# Altium schematic sheet con-bot-j2-0.SchDoc: Connector - J2(Bottom) 0
size Letter; CheckedBy: E. Chiu; CompanyName: Signal Laboratories, Inc.; DrawnBy: J. Brinton; Engineer: J. Brinton; Address1: 3479 Edison Way; Address2: Menlo Park CA 94025; Address3: +1 (877) 778-8435; Address4: brintonengineering.com; Revision: 1; SheetNumber: 20; SheetTotal: 40
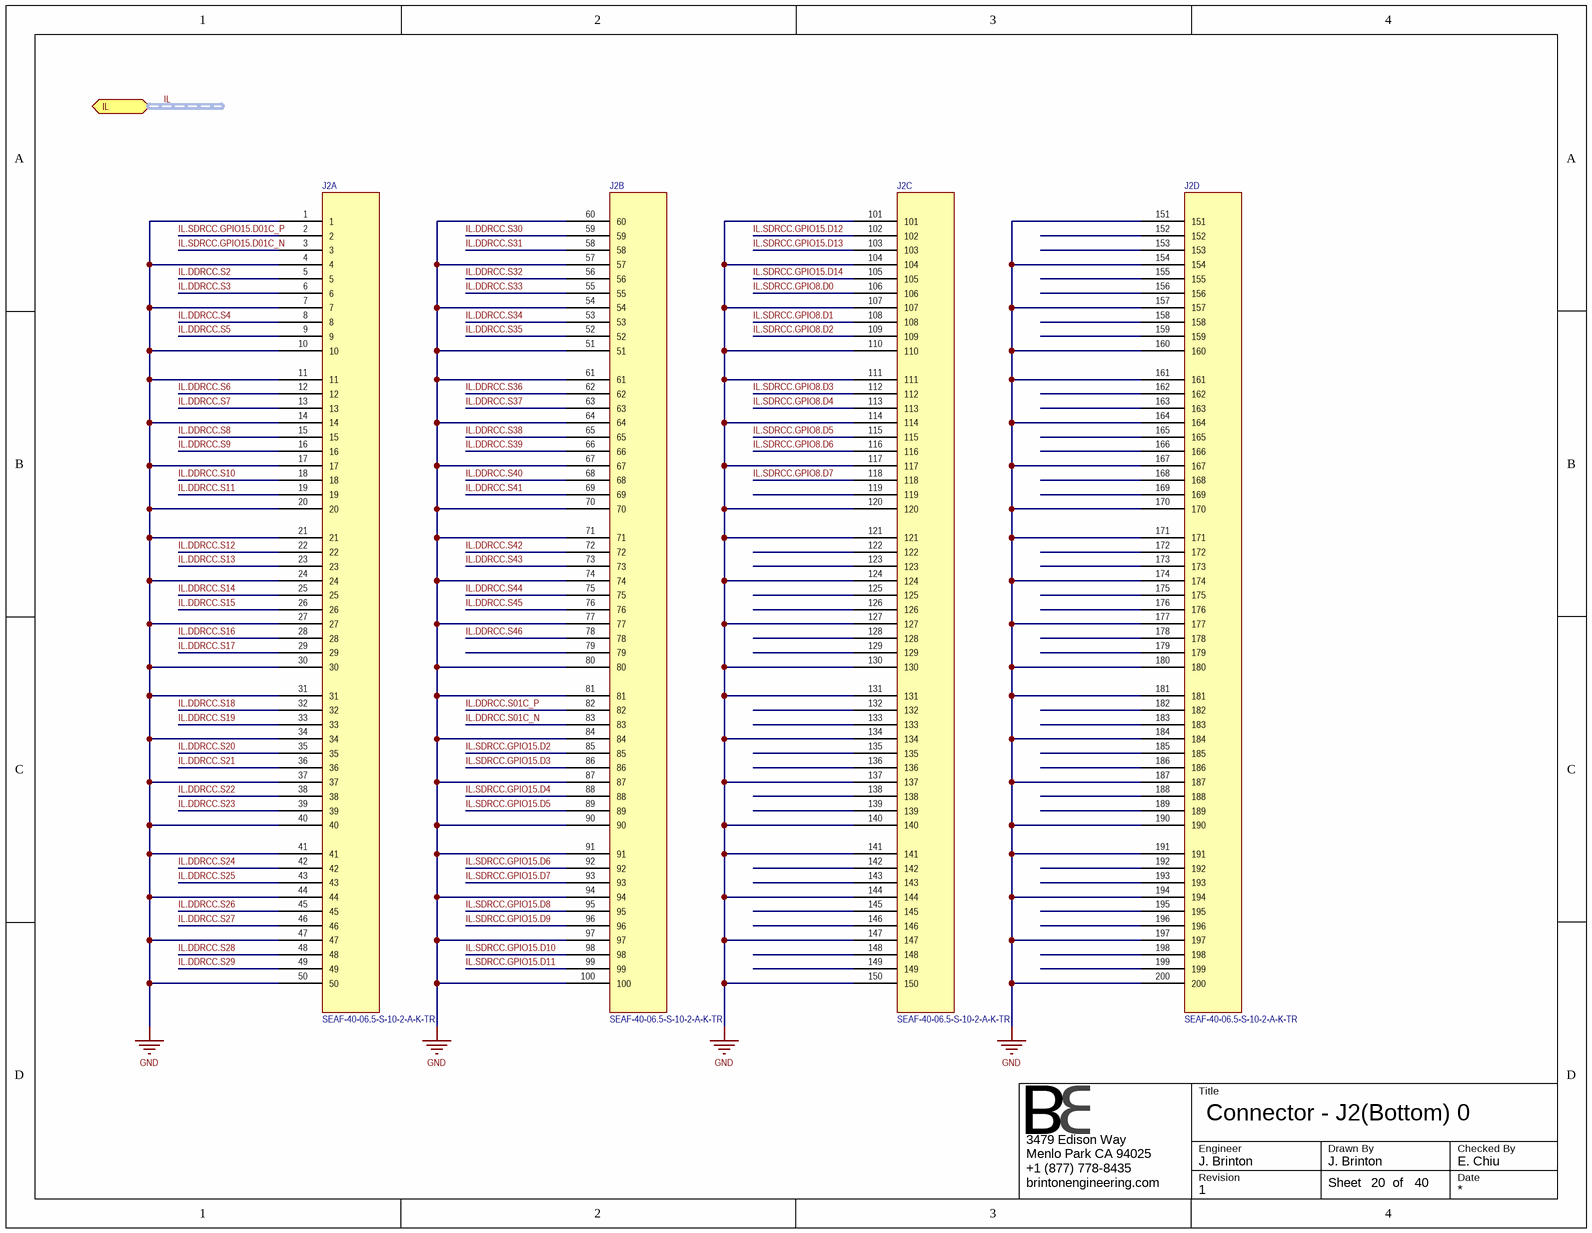
[diagram p0: con-bot-j2-0.SchDoc]

## Parts
J2  SEAF-40-06.5-S-10-2-A-K-TR  [SEAF-40-06.5-S-10-2-A-K-TR]  (parts A,B,C,D of 8)

## Ports
IL (harness IL-1V5)

## Nets
GND: J2.1 J2.4 J2.7 J2.10 J2.11 J2.14 J2.17 J2.20 J2.21 J2.24 J2.27 J2.30 J2.31 J2.34 J2.37 J2.40 J2.41 J2.44 J2.47 J2.50 J2.51 J2.54 J2.57 J2.60 J2.61 J2.64 J2.67 J2.70 J2.71 J2.74 J2.77 J2.80 J2.81 J2.84 J2.87 J2.90 J2.91 J2.94 J2.97 J2.100 J2.101 J2.104 J2.107 J2.110 J2.111 J2.114 J2.117 J2.120 J2.121 J2.124 J2.127 J2.130 J2.131 J2.134 J2.137 J2.140 J2.141 J2.144 J2.147 J2.150 J2.151 J2.154 J2.157 J2.160 J2.161 J2.164 J2.167 J2.170 J2.171 J2.174 J2.177 J2.180 J2.181 J2.184 J2.187 J2.190 J2.191 J2.194 J2.197 J2.200
IL.DDRCC.S01C_N: J2.83
IL.DDRCC.S01C_P: J2.82
IL.DDRCC.S2: J2.5
IL.DDRCC.S3: J2.6
IL.DDRCC.S4: J2.8
IL.DDRCC.S5: J2.9
IL.DDRCC.S6: J2.12
IL.DDRCC.S7: J2.13
IL.DDRCC.S8: J2.15
IL.DDRCC.S9: J2.16
IL.DDRCC.S10: J2.18
IL.DDRCC.S11: J2.19
IL.DDRCC.S12: J2.22
IL.DDRCC.S13: J2.23
IL.DDRCC.S14: J2.25
IL.DDRCC.S15: J2.26
IL.DDRCC.S16: J2.28
IL.DDRCC.S17: J2.29
IL.DDRCC.S18: J2.32
IL.DDRCC.S19: J2.33
IL.DDRCC.S20: J2.35
IL.DDRCC.S21: J2.36
IL.DDRCC.S22: J2.38
IL.DDRCC.S23: J2.39
IL.DDRCC.S24: J2.42
IL.DDRCC.S25: J2.43
IL.DDRCC.S26: J2.45
IL.DDRCC.S27: J2.46
IL.DDRCC.S28: J2.48
IL.DDRCC.S29: J2.49
IL.DDRCC.S30: J2.59
IL.DDRCC.S31: J2.58
IL.DDRCC.S32: J2.56
IL.DDRCC.S33: J2.55
IL.DDRCC.S34: J2.53
IL.DDRCC.S35: J2.52
IL.DDRCC.S36: J2.62
IL.DDRCC.S37: J2.63
IL.DDRCC.S38: J2.65
IL.DDRCC.S39: J2.66
IL.DDRCC.S40: J2.68
IL.DDRCC.S41: J2.69
IL.DDRCC.S42: J2.72
IL.DDRCC.S43: J2.73
IL.DDRCC.S44: J2.75
IL.DDRCC.S45: J2.76
IL.DDRCC.S46: J2.78
IL.SDRCC.GPIO8.D0: J2.106
IL.SDRCC.GPIO8.D1: J2.108
IL.SDRCC.GPIO8.D2: J2.109
IL.SDRCC.GPIO8.D3: J2.112
IL.SDRCC.GPIO8.D4: J2.113
IL.SDRCC.GPIO8.D5: J2.115
IL.SDRCC.GPIO8.D6: J2.116
IL.SDRCC.GPIO8.D7: J2.118
IL.SDRCC.GPIO15.D01C_N: J2.3
IL.SDRCC.GPIO15.D01C_P: J2.2
IL.SDRCC.GPIO15.D2: J2.85
IL.SDRCC.GPIO15.D3: J2.86
IL.SDRCC.GPIO15.D4: J2.88
IL.SDRCC.GPIO15.D5: J2.89
IL.SDRCC.GPIO15.D6: J2.92
IL.SDRCC.GPIO15.D7: J2.93
IL.SDRCC.GPIO15.D8: J2.95
IL.SDRCC.GPIO15.D9: J2.96
IL.SDRCC.GPIO15.D10: J2.98
IL.SDRCC.GPIO15.D11: J2.99
IL.SDRCC.GPIO15.D12: J2.102
IL.SDRCC.GPIO15.D13: J2.103
IL.SDRCC.GPIO15.D14: J2.105

Not connected (* = marked no-connect by the designer): J2 79 119 122 123 125 126 128 129 132 133 135 136 138 139 142 143 145 146 148 149 152 153 155 156 158 159 162 163 165 166 168 169 172 173 175 176 178 179 182 183 185 186 188 189 192 193 195 196 198 199

## Buses and harness runs
harness IL = port IL

## Notes on the sheet
- Title
- Engineer
- Revision
- Drawn By
- Checked By
- Date
- Sheet
- of

## Library data of the parts
J2 = SEAF-40-06.5-S-10-2-A-K-TR: Terminal Array Assembly, Surface Mount, 0.050" Pitch, 400 Pins; Manufacturer: Samtec; Manufacturer P/N: SEAF-40-06.5-S-10-2-A-K-TR